# Altium schematic sheet emi_filter_ch0_b.SchDoc: EMI Filter CH0 B
size A4; Date: 2015-10-11; Author: Piotr Kuligowski; Revision: 1-0; SheetNumber: 6; SheetTotal: 8; Model: EM1
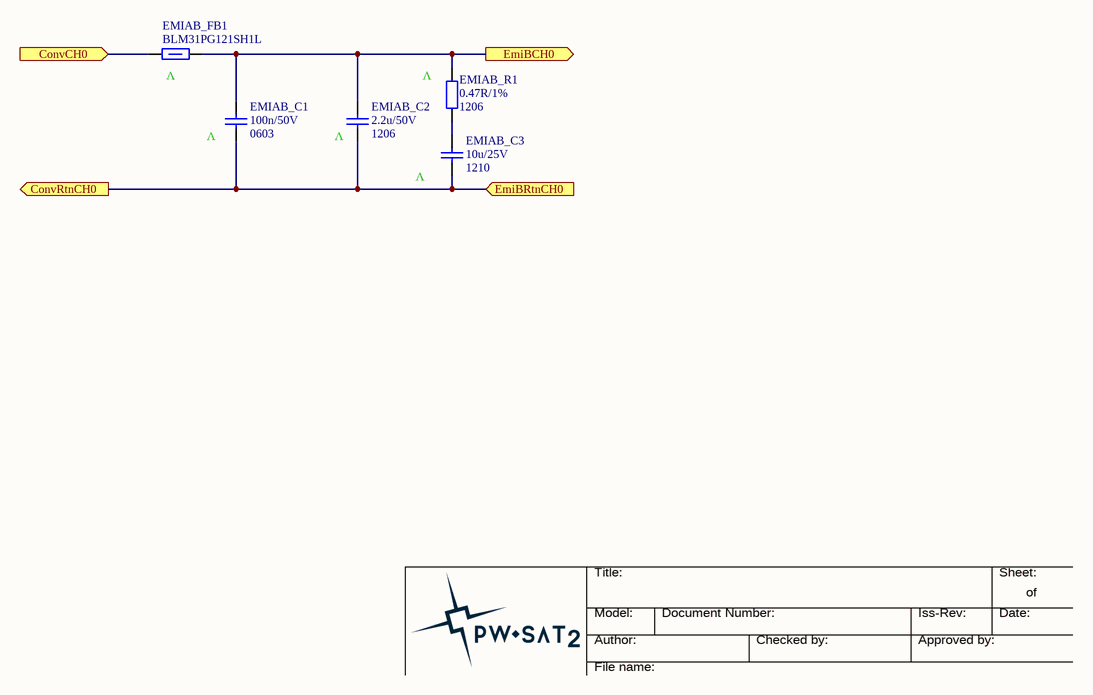
[diagram p0: emi_filter_ch0_b.SchDoc]

## Parts
EMIAB_C1  Package: 0603  [SMD_Capacitor_0603]  (hidden comment: 100n/50V)
EMIAB_C2  Package: 1206  [SMD_Capacitor_1206]  (hidden comment: 2.2u/50V)
EMIAB_C3  Package: 1210  [SMD_Capacitor_1210]  (hidden comment: 10u/25V)
EMIAB_FB1  120R/100MHz  [SMD_FerriteBead_1206]  (value not drawn)
EMIAB_R1  Package: 1206  [SMD_Resistor_1206]  (hidden comment: 0.47R/1%)

## Ports
ConvCH0 (in), ConvRtnCH0 (out), EmiBCH0 (out), EmiBRtnCH0 (in)

## Nets
ConvCH0: EMIAB_FB1.2 ; port ConvCH0
ConvRtnCH0: EMIAB_C1.2 EMIAB_C2.2 EMIAB_C3.2 ; port ConvRtnCH0, port EmiBRtnCH0
EmiBCH0: EMIAB_C1.1 EMIAB_C2.1 EMIAB_FB1.1 EMIAB_R1.2 ; port EmiBCH0
NetEMIAB_C3_1: EMIAB_C3.1 EMIAB_R1.1

## Notes on the sheet
- (near EMIAB_FB1) V
- (near EMIAB_R1) V
- (near EMIAB_C1) V
- (near EMIAB_C2) V
- (near EMIAB_C3) V
- Title:
- Sheet:
- of
- Author:
- Model:
- Document Number:
- Checked by:
- Iss-Rev:
- Approved by:
- Date:
- File name:

## Library data of the parts
EMIAB_C1 = Cer_C0603T104K5RALTU: Ceramic Cap Kemet COTS 100n/50V X7R 0603; Manufacturer: Kemet; ManufacturerPartNumber: C0603T104K5RALTU; Value: 100n/50V
EMIAB_C2 = Cer_GCJ31CR71H225KA12L: Ceramic Cap Murata Automotive 2.2u/50V X7R 1206; Manufacturer: Murata; ManufacturerPartNumber: GCJ31CR71H225KA12L; Value: 2.2u/50V
EMIAB_C3 = Cer_GCJ32ER71E106KA12L: Ceramic Cap Murata Automotive 10u/25V X7R 1210; Manufacturer: Murata; ManufacturerPartNumber: GCJ32ER71E106KA12L; Value: 10u/25V
EMIAB_FB1 = BLM31PG121SH1L: Ferrite bead, 1206, 0.02HM, 3.5A.; Manufacturer: Murata; Current Rating: 3.5A; Series Resistance DC: 0.02R; Package: 1206; Value: 120R/100MHz; ManufacturerPartNumber: BLM31PG121SH1L
EMIAB_R1 = ERJ-8BQFR47V: Panasonic Resistor 0.47R 1% 1206 330mW; ManufacturerPartNumber: ERJ-8BQFR47V; Manufacturer: Panasonic; Value: 0.47R/1%